# Altium schematic sheet main.SchDoc
size A4; SheetNumber: 1; SheetTotal: 2
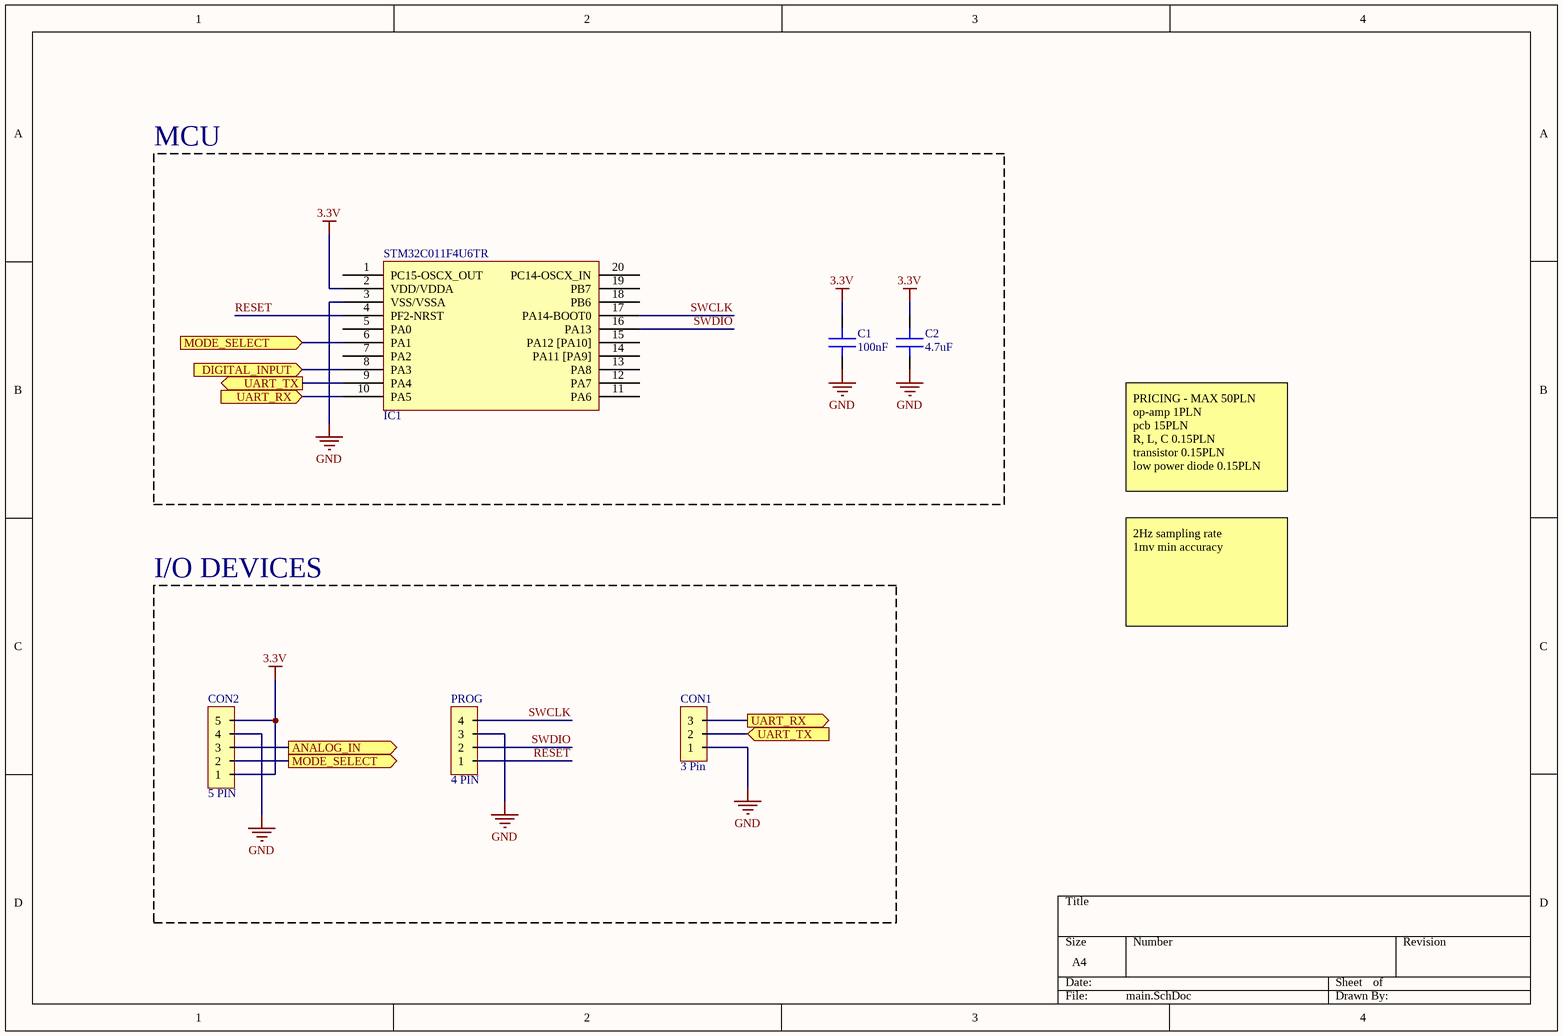
[diagram p0: main.SchDoc]

## Parts
C1  100nF  [C 0603]
C2  4.7uF  [C 0603]
CON1  3 Pin  [Goldpin 2.54MM 3P]
CON2  5 PIN  [Goldpin 2.54mm 5P]
IC1  STM32C011F4U6TR  [UFQFPN20 - byMe]  (value not drawn)
PROG  4 PIN  [BM04B-SRSS-TB]

## Blocks framed on the sheet
MCU: C1 C2 IC1
I/O DEVICES: CON1 CON2 PROG

## Ports
ANALOG_IN (out), DIGITAL_INPUT (in), MODE_SELECT (in), MODE_SELECT (out), UART_RX (in), UART_RX (out), UART_TX (in), UART_TX (out)

## Nets
3.3V: C1.1 C2.1 CON2.1 CON2.5 IC1.2(VDD/VDDA)
GND: C1.2 C2.2 CON1.1 CON2.4 IC1.3(VSS/VSSA) PROG.3
ANALOG_IN: CON2.3 ; port ANALOG_IN
DIGITAL_INPUT: IC1.8(PA3) ; port DIGITAL_INPUT
MODE_SELECT: CON2.2 IC1.6(PA1) ; port MODE_SELECT
RESET: IC1.4(PF2-NRST) PROG.1
SWCLK: IC1.17(PA14-BOOT0) PROG.4
SWDIO: IC1.16(PA13) PROG.2
UART_RX: CON1.3 IC1.10(PA5) ; port UART_RX
UART_TX: CON1.2 IC1.9(PA4) ; port UART_TX

Not connected (* = marked no-connect by the designer): IC1 1(PC15-OSCX_OUT) 5(PA0) 7(PA2) 11(PA6) 12(PA7) 13(PA8) 14(PA11_[PA9]) 15(PA12_[PA10]) 18(PB6) 19(PB7) 20(PC14-OSCX_IN)

## Notes on the sheet
- PRICING - MAX 50PLN
  op-amp 1PLN
  pcb 15PLN
  R, L, C 0.15PLN
  transistor 0.15PLN
  low power diode 0.15PLN
- 2Hz sampling rate
  1mv min accuracy

## Library data of the parts
C1 C2 = Capacitor: MLCC Capacitor
IC1 = STM32C011F4U6TR: ComponentLink1Description: Datasheet; ComponentLink1URL: https://www.alldatasheet.com/datasheet-pdf/download/1583958/STMICROELECTRONICS/STM32C011F4U6TR.html